# Altium schematic sheet Sheet1.SchDoc
size A4
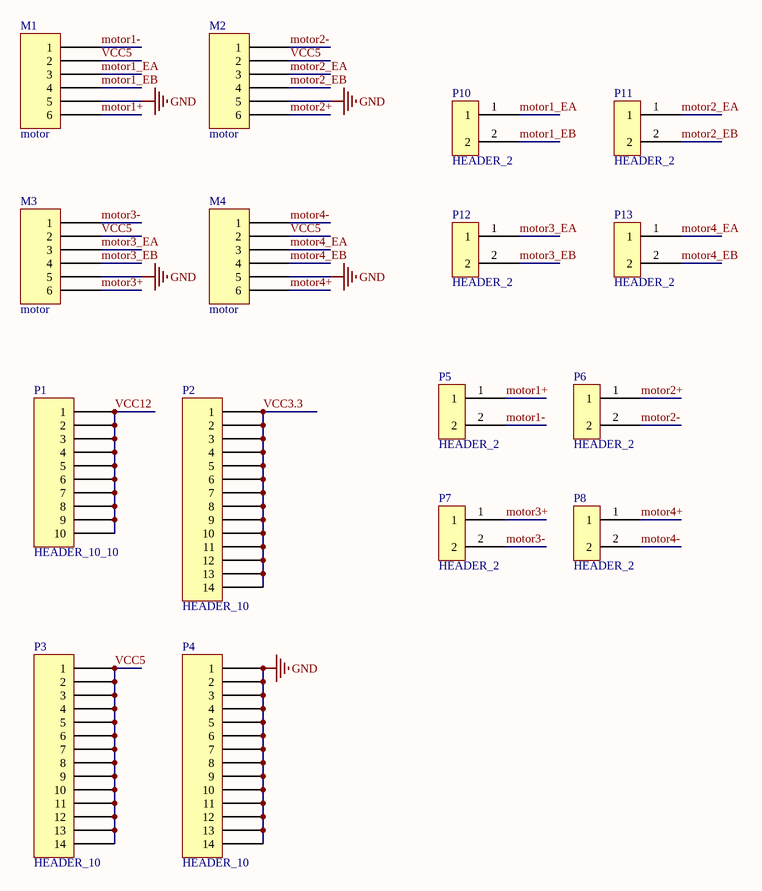
[diagram p0: Sheet1.SchDoc]

## Parts
M1  motor  [Header6]
M2  motor  [Header6]
M3  motor  [Header6]
M4  motor  [Header6]
P1  HEADER_10_10  [HDR1X10_10]
P2  HEADER_10  [HDR1X10]
P3  HEADER_10  [HDR1X10]
P4  HEADER_10  [HDR1X10]
P5  HEADER_2  [HDR1X2]
P6  HEADER_2  [HDR1X2]
P7  HEADER_2  [HDR1X2]
P8  HEADER_2  [HDR1X2]
P10  HEADER_2  [HDR1X2]
P11  HEADER_2  [HDR1X2]
P12  HEADER_2  [HDR1X2]
P13  HEADER_2  [HDR1X2]

## Nets
GND: M1.5 M2.5 M3.5 M4.5 P4.1 P4.2 P4.3 P4.4 P4.5 P4.6 P4.7 P4.8 P4.9 P4.10 P4.11 P4.12 P4.13 P4.14
motor1+: M1.6 P5.1
motor1-: M1.1 P5.2
motor1_EA: M1.3 P10.1
motor1_EB: M1.4 P10.2
motor2+: M2.6 P6.1
motor2-: M2.1 P6.2
motor2_EA: M2.3 P11.1
motor2_EB: M2.4 P11.2
motor3+: M3.6 P7.1
motor3-: M3.1 P7.2
motor3_EA: M3.3 P12.1
motor3_EB: M3.4 P12.2
motor4+: M4.6 P8.1
motor4-: M4.1 P8.2
motor4_EA: M4.3 P13.1
motor4_EB: M4.4 P13.2
VCC3.3: P2.1 P2.2 P2.3 P2.4 P2.5 P2.6 P2.7 P2.8 P2.9 P2.10 P2.11 P2.12 P2.13 P2.14
VCC5: M1.2 M2.2 M3.2 M4.2 P3.1 P3.2 P3.3 P3.4 P3.5 P3.6 P3.7 P3.8 P3.9 P3.10 P3.11 P3.12 P3.13 P3.14
VCC12: P1.1 P1.2 P1.3 P1.4 P1.5 P1.6 P1.7 P1.8 P1.9 P1.10